# Altium project PCB__HMI3D_backup.PrjPCB
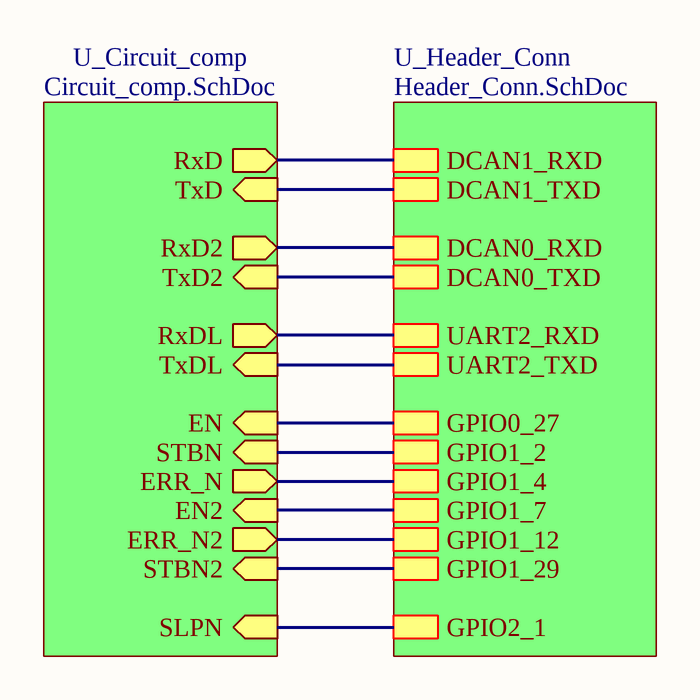
[diagram p0: Circuit.SchDoc]
9 sheets, 49 parts. Net scope: hierarchical (ports join the sheet entries above them; power ports are global).
Board file: Circuit.PcbDoc
Sheets:
  Circuit.SchDoc
  Power_Sources_2.SchDoc
    U_3 = 3.3V_REG_1mA.SchDoc
    U_5V_REG_EN = 5V_REG_EN.SchDoc
  3.3V_REG_1A.SchDoc
  3.3V_REG_EN.SchDoc
  Power_Sources.SchDoc
    U_EMI_Prot_1 = EMI_Prot.SchDoc
    U_EMI_Prot_2 = EMI_Prot.SchDoc
  EMI_Prot_Circ.SchDoc

## Sheet Circuit.SchDoc
size A4

### Sub-sheets
U_Circuit_comp = Circuit_comp.SchDoc (file not in this document): STBN2 (in), EN2 (in), TxD2 (in), ERR_N2 (out), RxD2 (out), RxDL (out), TxDL (in), SLPN (in), ERR_N (out), RxD (out), STBN (in), EN (in), TxD (in)
U_Header_Conn = Header_Conn.SchDoc (file not in this document): GPIO1_2, GPIO0_27, GPIO1_7, GPIO1_12, GPIO1_29, DCAN0_RXD, UART2_TXD, DCAN0_TXD, UART2_RXD, DCAN1_RXD, DCAN1_TXD, GPIO1_4, GPIO2_1

### Nets
(unnamed): sheet U_Circuit_comp/STBN2, sheet U_Header_Conn/GPIO1_29
(unnamed): sheet U_Circuit_comp/EN2, sheet U_Header_Conn/GPIO1_7
(unnamed): sheet U_Circuit_comp/TxD2, sheet U_Header_Conn/DCAN0_TXD
(unnamed): sheet U_Circuit_comp/ERR_N2, sheet U_Header_Conn/GPIO1_12
(unnamed): sheet U_Circuit_comp/RxD2, sheet U_Header_Conn/DCAN0_RXD
(unnamed): sheet U_Circuit_comp/RxDL, sheet U_Header_Conn/UART2_RXD
(unnamed): sheet U_Circuit_comp/TxDL, sheet U_Header_Conn/UART2_TXD
(unnamed): sheet U_Circuit_comp/SLPN, sheet U_Header_Conn/GPIO2_1
(unnamed): sheet U_Circuit_comp/ERR_N, sheet U_Header_Conn/GPIO1_4
(unnamed): sheet U_Circuit_comp/RxD, sheet U_Header_Conn/DCAN1_RXD
(unnamed): sheet U_Circuit_comp/STBN, sheet U_Header_Conn/GPIO1_2
(unnamed): sheet U_Circuit_comp/EN, sheet U_Header_Conn/GPIO0_27
(unnamed): sheet U_Circuit_comp/TxD, sheet U_Header_Conn/DCAN1_TXD

## Sheet Power_Sources_2.SchDoc
size A4
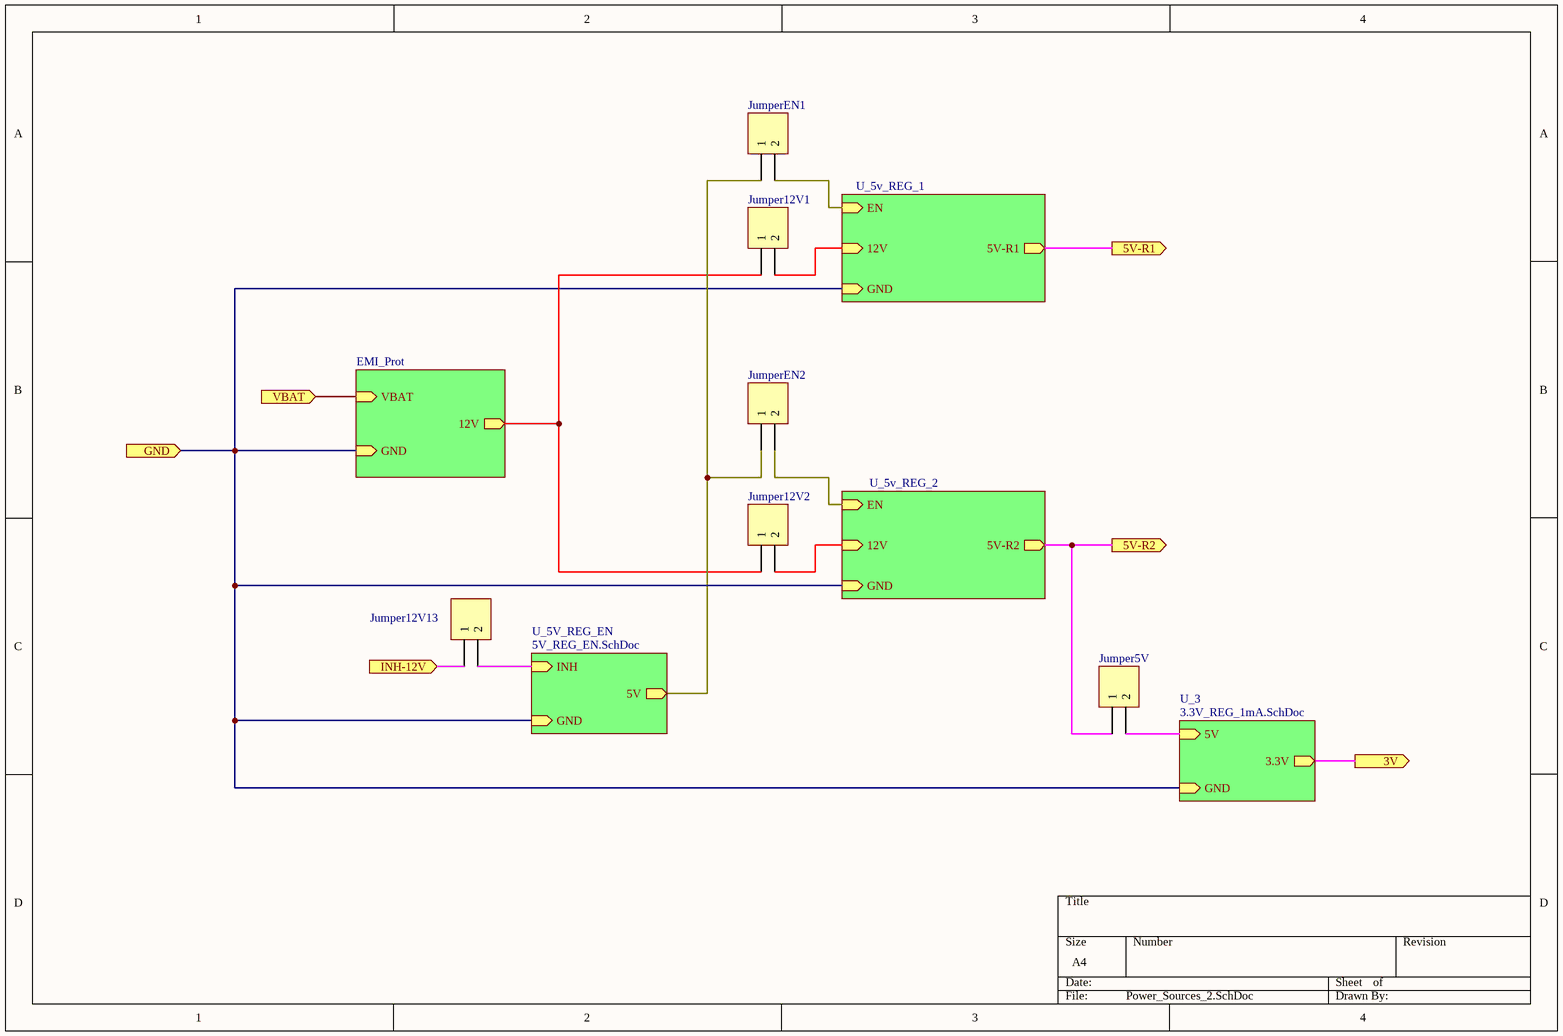
[diagram p1: Power_Sources_2.SchDoc]

### Parts
Jumper5V  Header 2H  [HDR1X2H]  (value not drawn)
Jumper12V1  Header 2H  [HDR1X2H]  (value not drawn)
Jumper12V2  Header 2H  [HDR1X2H]  (value not drawn)
Jumper12V13  Header 2H  [HDR1X2H]  (value not drawn)
JumperEN1  Header 2H  [HDR1X2H]  (value not drawn)
JumperEN2  Header 2H  [HDR1X2H]  (value not drawn)

### Sub-sheets
EMI_Prot = ?: VBAT (in), GND (in), 12V (out)
U_3 = 3.3V_REG_1mA.SchDoc: 5V (in), GND (in), 3.3V (out)
U_5v_REG_1 = ?: 12V (in), GND (in), EN (in), 5V-R1 (out)
U_5v_REG_2 = ?: 12V (in), GND (in), EN (in), 5V-R2 (out)
U_5V_REG_EN = 5V_REG_EN.SchDoc: INH (in), GND (in), 5V (out)

### Ports
3V (out), 5V-R1 (out), 5V-R2 (out), GND (in), INH-12V (in), VBAT (in)

### Nets
GND: port GND, sheet U_5v_REG_1/GND, sheet U_5v_REG_2/GND, sheet EMI_Prot/GND, sheet U_3/GND, sheet U_5V_REG_EN/GND
NetC?#1_1: port 3V, sheet U_3/3.3V
NetC?#2_2: Jumper5V.2 ; sheet U_3/5V
NetC?#4_1: JumperEN1.1 JumperEN2.1 ; sheet U_5V_REG_EN/5V
NetC?#5_2: Jumper12V13.2 ; sheet U_5V_REG_EN/INH
NetJumper5V_1: Jumper5V.1 ; port 5V-R2, sheet U_5v_REG_2/5V-R2
NetJumper12V1_1: Jumper12V1.1 Jumper12V2.1 ; sheet EMI_Prot/12V
NetJumper12V1_2: Jumper12V1.2 ; sheet U_5v_REG_1/12V
NetJumper12V2_2: Jumper12V2.2 ; sheet U_5v_REG_2/12V
NetJumper12V13_1: Jumper12V13.1 ; port INH-12V
NetJumperEN1_2: JumperEN1.2 ; sheet U_5v_REG_1/EN
NetJumperEN2_2: JumperEN2.2 ; sheet U_5v_REG_2/EN
(unnamed): port VBAT, sheet EMI_Prot/VBAT
(unnamed): port 5V-R1, sheet U_5v_REG_1/5V-R1

### Library data of the parts
Jumper5V Jumper12V1 Jumper12V2 Jumper12V13 JumperEN1 JumperEN2 = Header 2H: Header, 2-Pin, Right Angle; LatestRevisionDate: 17-Jul-2002; LatestRevisionNote: Re-released for DXP Platform.; Publisher: Altium Limited

## Sheet 3.3V_REG_1mA.SchDoc
size A4
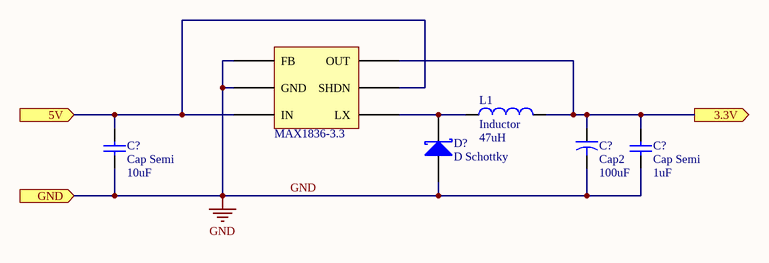
[diagram p2: 3.3V_REG_1mA.SchDoc]

### Parts
(Parts that share a designator on the sheet are numbered #1, #2 ... from top to bottom, then left to right.)
C?#1  Cap2  value 100uF  [CAPR5-4X5]
C?#2  Cap Semi  value 10uF  [C2512]
C?#3  Cap Semi  value 1uF  [C1206]
D?#1  D Schottky  [SMB]
L1#1  Inductor  value 47uH  [0402-A]
MAX1836-3.3#1  MAX1836-3.3V  [SOT23-MAX1836]  (value not drawn)

### Ports
3.3V (out), 5V (in), GND (in)

### Nets
GND: C?#1.2 C?#2.1 C?#3.1 D?#1.1(A) MAX1836-3.3#1.FB MAX1836-3.3#1.GND ; port GND
NetC?#1_1: C?#1.1 C?#3.2 L1#1.2 MAX1836-3.3#1.OUT ; port 3.3V
NetC?#2_2: C?#2.2 MAX1836-3.3#1.IN MAX1836-3.3#1.SHDN ; port 5V
NetD?#1_2: D?#1.2(K) L1#1.1 MAX1836-3.3#1.LX

### Library data of the parts
C?#1 = Cap2: Capacitor; Published: 23-Sep-2002; PackageReference: CAPR5-4X5; Publisher: Altium Limited; PackageDescription: Capacitor; 2 Leads
C?#2 C?#3 = Cap Semi: Capacitor (Semiconductor SIM Model); Published: 8-Jun-2000; LatestRevisionDate: 29-May-2009; LatestRevisionNote: IPC-7351 Footprint Added.; PackageReference: C1206; Publisher: Altium Limited; PackageDescription: Chip Capacitor
D?#1 = D Schottky: Schottky Diode; Published: 8-Jun-2000; LatestRevisionDate: 17-Jul-2002; LatestRevisionNote: Re-released for DXP Platform.; PackageReference: SMB; Publisher: Altium Limited; PackageDescription: DO-214-AA/SMB; 2 C-Bend Leads; Body 5.3 x 3.6 mm, inc. leads (LxW); Code_JEDEC: DO-214-AA
L1#1 = Inductor: Code_IEC: 1005; Published: 8-Jun-2000; LatestRevisionDate: 29-May-2009; LatestRevisionNote: IPC-7351 Footprint Added.; PackageReference: 0402-A; Publisher: Altium Limited; PackageDescription: Chip Inductor; Code_JEITA: 0402
MAX1836-3.3#1 = MAX1836-3.3V: 3.3V Fixed voltage regulator (125mA); HelpURL: http://www.mouser.com/ds/2/256/MAX1836-MAX1837-257737.pdf

## Sheet 5V_REG_EN.SchDoc
size A4
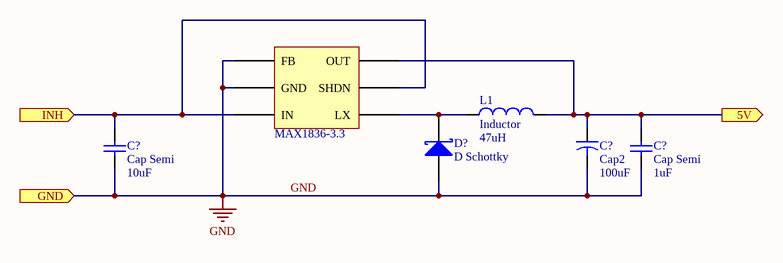
[diagram p3: 5V_REG_EN.SchDoc]

### Parts
(Parts that share a designator on the sheet are numbered #1, #2 ... from top to bottom, then left to right.)
C?#4  Cap2  value 100uF  [CAPR5-4X5]
C?#5  Cap Semi  value 10uF  [C2512]
C?#6  Cap Semi  value 1uF  [C1206]
D?#2  D Schottky  [SMB]
L1#2  Inductor  value 47uH  [0402-A]
MAX1836-3.3#2  MAX1836-3.3V  [SOT23-MAX1836]  (value not drawn)

### Ports
5V (out), GND (in), INH (in)

### Nets
GND: C?#4.2 C?#5.1 C?#6.1 D?#2.1(A) MAX1836-3.3#2.FB MAX1836-3.3#2.GND ; port GND
NetC?#4_1: C?#4.1 C?#6.2 L1#2.2 MAX1836-3.3#2.OUT ; port 5V
NetC?#5_2: C?#5.2 MAX1836-3.3#2.IN MAX1836-3.3#2.SHDN ; port INH
NetD?#2_2: D?#2.2(K) L1#2.1 MAX1836-3.3#2.LX

### Library data of the parts
C?#4 = Cap2: Capacitor; Published: 23-Sep-2002; PackageReference: CAPR5-4X5; Publisher: Altium Limited; PackageDescription: Capacitor; 2 Leads
C?#5 C?#6 = Cap Semi: Capacitor (Semiconductor SIM Model); Published: 8-Jun-2000; LatestRevisionDate: 29-May-2009; LatestRevisionNote: IPC-7351 Footprint Added.; PackageReference: C1206; Publisher: Altium Limited; PackageDescription: Chip Capacitor
D?#2 = D Schottky: Schottky Diode; Published: 8-Jun-2000; LatestRevisionDate: 17-Jul-2002; LatestRevisionNote: Re-released for DXP Platform.; PackageReference: SMB; Publisher: Altium Limited; PackageDescription: DO-214-AA/SMB; 2 C-Bend Leads; Body 5.3 x 3.6 mm, inc. leads (LxW); Code_JEDEC: DO-214-AA
L1#2 = Inductor: Code_IEC: 1005; Published: 8-Jun-2000; LatestRevisionDate: 29-May-2009; LatestRevisionNote: IPC-7351 Footprint Added.; PackageReference: 0402-A; Publisher: Altium Limited; PackageDescription: Chip Inductor; Code_JEITA: 0402
MAX1836-3.3#2 = MAX1836-3.3V: 3.3V Fixed voltage regulator (125mA); HelpURL: http://www.mouser.com/ds/2/256/MAX1836-MAX1837-257737.pdf

## Sheet 3.3V_REG_1A.SchDoc
size A4
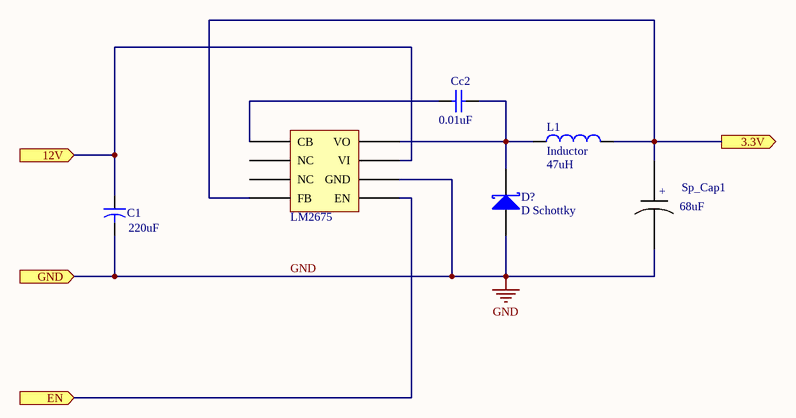
[diagram p4: 3.3V_REG_1A.SchDoc]

### Parts
(Parts that share a designator on the sheet are numbered #1, #2 ... from top to bottom, then left to right.)
C1#1  value 220uF  [CAPR5-4X5]  (hidden comment: Cap2)
Cc2  value 0.01uF  [C1206]  (hidden comment: Cap Semi)
D?#3  D Schottky  [SMB]
L1#3  Inductor  value 47uH  [0402-A]
LM2675  LM2675  [SOIC8-LM2675]  (value not drawn)
Sp_Cap1#1  value 68uF  (hidden comment: Sprague_capacitor)

### Ports
3.3V (out), 12V (in), EN (in), GND (in)

### Nets
GND: C1#1.2 D?#3.1(A) LM2675.GND Sp_Cap1#1.?2 ; port GND
NetC1#1_1: C1#1.1 LM2675.VI ; port 12V
NetCc2_1: Cc2.1 LM2675.CB
NetCc2_2: Cc2.2 D?#3.2(K) L1#3.1 LM2675.VO
NetL1#3_2: L1#3.2 LM2675.FB Sp_Cap1#1.?1 ; port 3.3V
NetLM2675_EN: LM2675.EN ; port EN

Not connected (* = marked no-connect by the designer): LM2675 NC

### Notes on the sheet
- (in symbol Sprague_capacitor) +

### Library data of the parts
C1#1 = Cap2: Capacitor; Published: 23-Sep-2002; PackageReference: CAPR5-4X5; Publisher: Altium Limited; PackageDescription: Capacitor; 2 Leads
Cc2 = Cap Semi: Capacitor (Semiconductor SIM Model); Published: 8-Jun-2000; LatestRevisionDate: 29-May-2009; LatestRevisionNote: IPC-7351 Footprint Added.; PackageReference: C1206; Publisher: Altium Limited; PackageDescription: Chip Capacitor
D?#3 = D Schottky: Schottky Diode; Published: 8-Jun-2000; LatestRevisionDate: 17-Jul-2002; LatestRevisionNote: Re-released for DXP Platform.; PackageReference: SMB; Publisher: Altium Limited; PackageDescription: DO-214-AA/SMB; 2 C-Bend Leads; Body 5.3 x 3.6 mm, inc. leads (LxW); Code_JEDEC: DO-214-AA
L1#3 = Inductor: Code_IEC: 1005; Published: 8-Jun-2000; LatestRevisionDate: 29-May-2009; LatestRevisionNote: IPC-7351 Footprint Added.; PackageReference: 0402-A; Publisher: Altium Limited; PackageDescription: Chip Inductor; Code_JEITA: 0402
LM2675 = LM2675: 3.3 Step-down (1A); HelpURL: http://www.ti.com/lit/ds/symlink/lm2675.pdf
Sp_Cap1#1 = Sprague_capacitor: Sprague Tantalum Capacitor; HelpURL: http://www.mouser.es/ProductDetail/Vishay-Sprague/594D686X0010C2T/?qs=sGAEpiMZZMuEN2agSAc2pn0KQ7q64aCR6Bnog1kvSjk%3d

## Sheet 3.3V_REG_EN.SchDoc
size A4
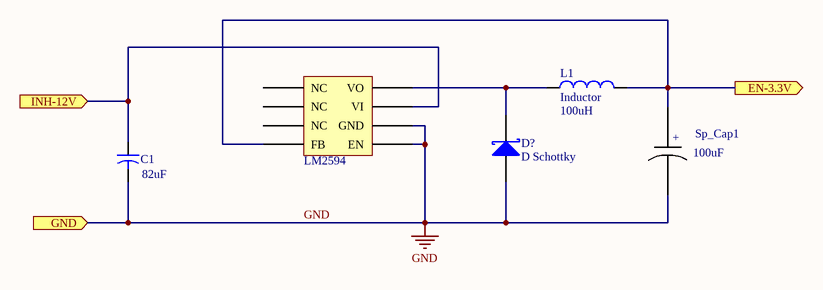
[diagram p5: 3.3V_REG_EN.SchDoc]

### Parts
(Parts that share a designator on the sheet are numbered #1, #2 ... from top to bottom, then left to right.)
C1#2  value 82uF  [CAPR5-4X5]  (hidden comment: Cap2)
D?#4  D Schottky  [SMB]
L1#4  Inductor  value 100uH  [0402-A]
LM2594  LM2594  [SOIC8-LM2594]  (value not drawn)
Sp_Cap1#2  value 100uF  (hidden comment: Sprague_capacitor)

### Ports
EN-3.3V (out), GND (in), INH-12V (in)

### Nets
GND: C1#2.2 D?#4.1(A) LM2594.EN LM2594.GND Sp_Cap1#2.?2 ; port GND
NetC1#2_1: C1#2.1 LM2594.VI ; port INH-12V
NetD?#4_2: D?#4.2(K) L1#4.1 LM2594.VO
NetL1#4_2: L1#4.2 LM2594.FB Sp_Cap1#2.?1 ; port EN-3.3V

Not connected (* = marked no-connect by the designer): LM2594 NC

### Notes on the sheet
- (in symbol Sprague_capacitor) +

### Library data of the parts
C1#2 = Cap2: Capacitor; Published: 23-Sep-2002; PackageReference: CAPR5-4X5; Publisher: Altium Limited; PackageDescription: Capacitor; 2 Leads
D?#4 = D Schottky: Schottky Diode; Published: 8-Jun-2000; LatestRevisionDate: 17-Jul-2002; LatestRevisionNote: Re-released for DXP Platform.; PackageReference: SMB; Publisher: Altium Limited; PackageDescription: DO-214-AA/SMB; 2 C-Bend Leads; Body 5.3 x 3.6 mm, inc. leads (LxW); Code_JEDEC: DO-214-AA
L1#4 = Inductor: Code_IEC: 1005; Published: 8-Jun-2000; LatestRevisionDate: 29-May-2009; LatestRevisionNote: IPC-7351 Footprint Added.; PackageReference: 0402-A; Publisher: Altium Limited; PackageDescription: Chip Inductor; Code_JEITA: 0402
LM2594 = LM2594: 3.3 Step-down (0.5A); HelpURL: http://www.ti.com/lit/ds/symlink/lm2594.pdf
Sp_Cap1#2 = Sprague_capacitor: Sprague Tantalum Capacitor; HelpURL: http://www.mouser.es/ProductDetail/Vishay-Sprague/594D686X0010C2T/?qs=sGAEpiMZZMuEN2agSAc2pn0KQ7q64aCR6Bnog1kvSjk%3d

## Sheet Power_Sources.SchDoc
size A4
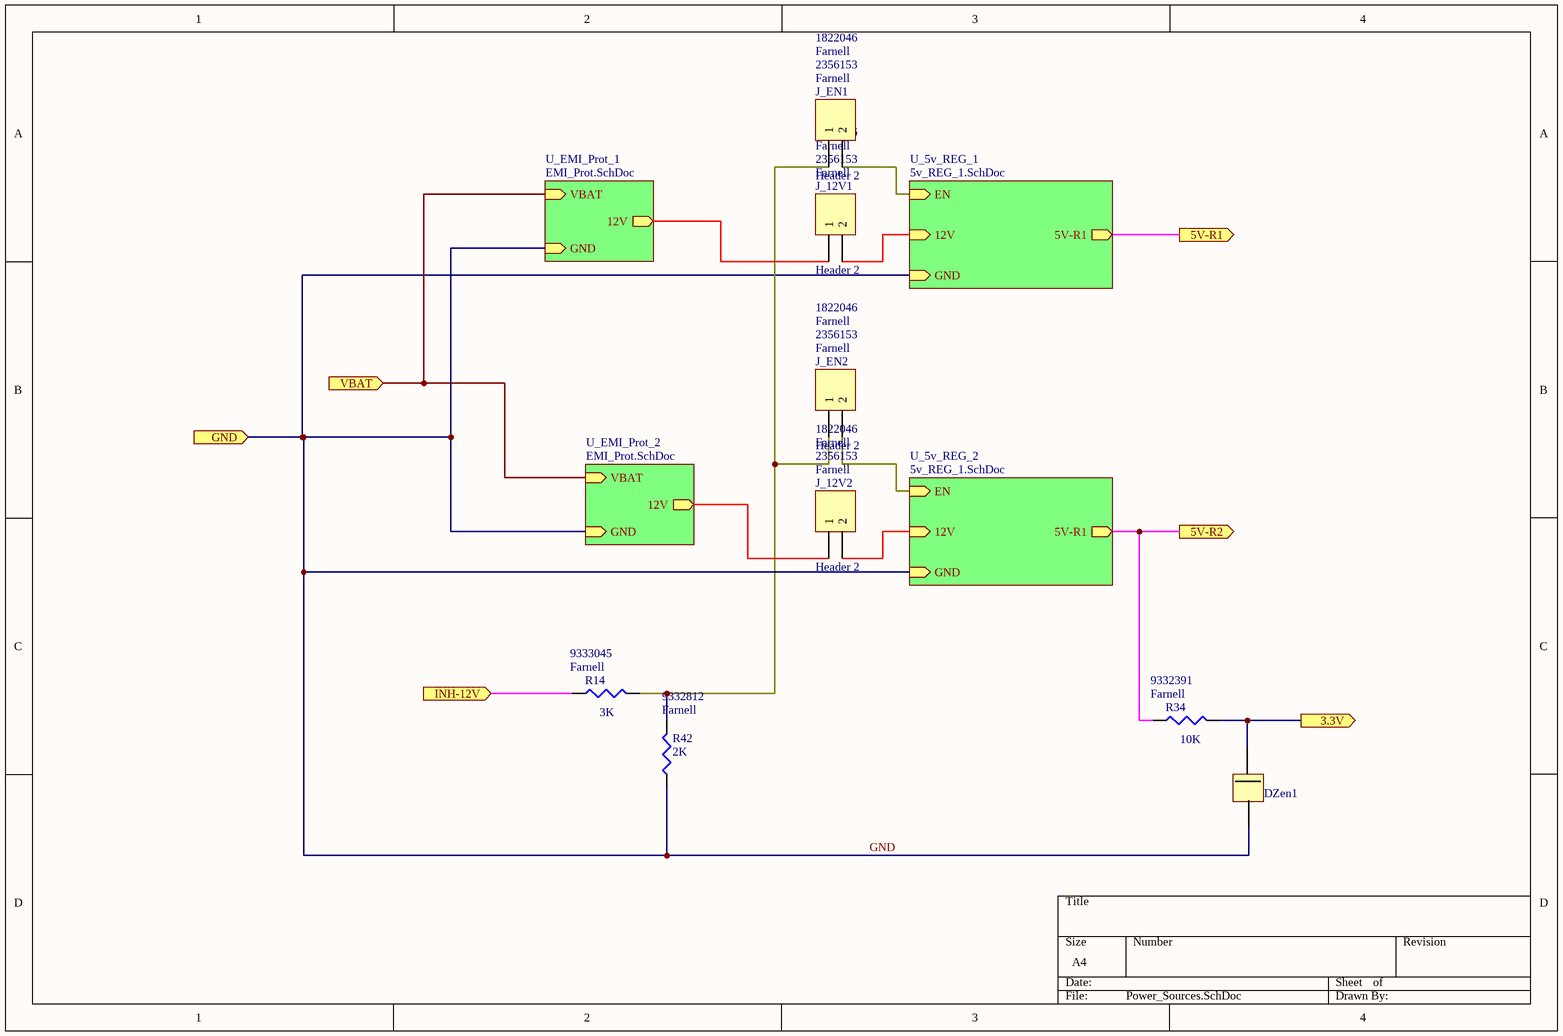
[diagram p6: Power_Sources.SchDoc]

### Parts
DZen1  3.3V  [Zener_Diode]  (value not drawn)
J_12V1  Header 2  Supplier 1: Farnell  Supplier Part Number 1: 2356153  Supplier Part Number 2: 1822046  [HDR1X2]
J_12V2  Header 2  Supplier 1: Farnell  Supplier Part Number 1: 2356153  Supplier Part Number 2: 1822046  [HDR1X2]
J_EN1  Header 2  Supplier 1: Farnell  Supplier Part Number 1: 2356153  Supplier Part Number 2: 1822046  [HDR1X2]
J_EN2  Header 2  Supplier 1: Farnell  Supplier Part Number 1: 2356153  Supplier Part Number 2: 1822046  [HDR1X2]
R14  Supplier 1: Farnell  Supplier Part Number 1: 9333045  [RES_0805]  (hidden comment: 3K)
R34  Supplier 1: Farnell  Supplier Part Number 1: 9332391  [RES_0805]  (hidden comment: 10K)
R42  Supplier 1: Farnell  Supplier Part Number 1: 9332812  [RES_0805]  (hidden comment: 2K)

### Sub-sheets
U_5v_REG_1 = 5v_REG_1.SchDoc (file not in this document): 12V (in), GND (in), EN (in), 5V-R1 (out)
U_5v_REG_2 = 5v_REG_1.SchDoc (file not in this document): 12V (in), GND (in), EN (in), 5V-R1 (out)
U_EMI_Prot_1 = EMI_Prot.SchDoc: VBAT (in), GND (in), 12V (out)
U_EMI_Prot_2 = EMI_Prot.SchDoc: VBAT (in), GND (in), 12V (out)

### Ports
3.3V (out), 5V-R1 (out), 5V-R2 (out), GND (in), INH-12V (in), VBAT (in)

### Nets
GND: DZen1.D2 R42.1 ; port GND, sheet U_5v_REG_1/GND, sheet U_5v_REG_2/GND, sheet U_EMI_Prot_1/GND, sheet U_EMI_Prot_2/GND
NetC1#3_1: port VBAT, sheet U_EMI_Prot_1/VBAT, sheet U_EMI_Prot_2/VBAT
NetDZen1_D1: DZen1.D1 R34.2 ; port 3.3V
NetJ_12V1_1: J_12V1.1 ; sheet U_EMI_Prot_1/12V
NetJ_12V1_2: J_12V1.2 ; sheet U_5v_REG_1/12V
NetJ_12V2_1: J_12V2.1 ; sheet U_EMI_Prot_2/12V
NetJ_12V2_2: J_12V2.2 ; sheet U_5v_REG_2/12V
NetJ_EN1_1: J_EN1.1 J_EN2.1 R14.2 R42.2
NetJ_EN1_2: J_EN1.2 ; sheet U_5v_REG_1/EN
NetJ_EN2_2: J_EN2.2 ; sheet U_5v_REG_2/EN
NetR14_1: R14.1 ; port INH-12V
NetR34_1: R34.1 ; port 5V-R2, sheet U_5v_REG_2/5V-R1
(unnamed): port 5V-R1, sheet U_5v_REG_1/5V-R1

### Library data of the parts
DZen1 = D_Zener: Zener Diode 3.3V; Supplier Part Number 1: 621-BZT52HC3V3WF-7; Supplier 1: Mouser; HelpURL: http://www.mouser.com/ds/2/115/BZT52HC2V4WF%20-%20BZT52HC47WF-948206.pdf
J_12V1 J_12V2 J_EN1 J_EN2 = Header 2: Header, 2-Pin; LatestRevisionDate: 17-Jul-2002; LatestRevisionNote: Re-released for DXP Platform.; Publisher: Altium Limited; Supplier 2: Farnell
R14 R34 R42 = Res3: Resistor; Published: 8-Jun-2000; LatestRevisionDate: 29-May-2009; LatestRevisionNote: IPC-7351 Footprint Added.; PackageReference: J1-0603; Publisher: Altium Limited; PackageDescription: Chip Resistor
  R14: Value: 3K
  R34: Value: 10K
  R42: Value: 2K

## Sheet EMI_Prot.SchDoc
size A4
Used 2 times, as channels U_EMI_Prot_1, U_EMI_Prot_2. Parts and nets are listed once, with the designators drawn on the sheet.
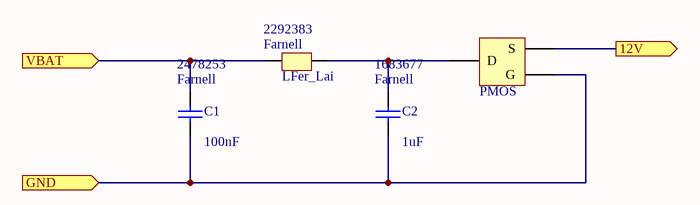
[diagram p7: EMI_Prot.SchDoc]

### Parts
C1  value 100nF  Supplier 1: Farnell  Supplier Part Number 1: 2478253  [CAP_0805]  (hidden comment: 100n)
C2  value 1uF  Supplier 1: Farnell  Supplier Part Number 1: 1683677  [CAP_0805]  (hidden comment: 1u)
LFer_Lai  Supplier 1: Farnell  Supplier Part Number 1: 2292383  [LFerrite_Laird]
PMOS  (no value)  [PMOS]

### Ports
12V (out), GND (in), VBAT (in)

### Nets
12V: PMOS.S ; port 12V
GND: C1.2 C2.2 PMOS.G ; port GND
VBAT: C1.1 LFer_Lai.1 ; port VBAT
NetC2_1: C2.1 LFer_Lai.2 PMOS.D

### Channels
U_EMI_Prot_1: designators C1=C1#3 C2=C2#1 LFer_Lai=LFer_L#1 PMOS=PMOS#1; ports 12V=NetJ_12V1_1 GND=GND VBAT=NetC1#3_1
U_EMI_Prot_2: designators C1=C1#4 C2=C2#2 LFer_Lai=LFer_L#2 PMOS=PMOS#2; ports 12V=NetJ_12V2_1 GND=GND VBAT=NetC1#3_1

### Library data of the parts
C1 C2 = Cap Semi: Capacitor; Published: 8-Jun-2000; LatestRevisionDate: 29-May-2009; LatestRevisionNote: IPC-7351 Footprint Added.; PackageReference: C1206; Publisher: Altium Limited; PackageDescription: Chip Capacitor
LFer_Lai = LFerrite_Laird: Laird ferrite chip bead; HelpURL: http://www.farnell.com/datasheets/1685731.pdf?_ga=1.185171822.65109063.1469090403
PMOS = PMOS: P channel Mosfet; HelpURL: http://www.mouser.com/ds/2/115/DMP6180SK3-247239.pdf

## Sheet EMI_Prot_Circ.SchDoc
size A4
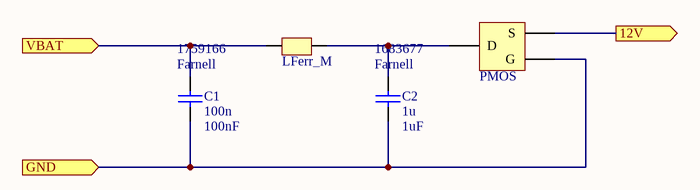
[diagram p8: EMI_Prot_Circ.SchDoc]

### Parts
(Parts that share a designator on the sheet are numbered #1, #2 ... from top to bottom, then left to right.)
C1#5  100n  value 100nF  Supplier 1: Farnell  Supplier Part Number 1: 1759166  [CAP_0805]
C2#3  1u  value 1uF  Supplier 1: Farnell  Supplier Part Number 1: 1683677  [CAP_0805]
LFerr_M  (no value)  [LFERRITE_MURATA_BLM21A]
PMOS#3  (no value)  [PMOS]

### Ports
12V (out), GND (in), VBAT (in)

### Nets
NetC1#5_1: C1#5.1 LFerr_M.1 ; port VBAT
NetC1#5_2: C1#5.2 C2#3.2 PMOS#3.G ; port GND
NetC2#3_1: C2#3.1 LFerr_M.2 PMOS#3.D
NetPMOS#3_S: PMOS#3.S ; port 12V

### Library data of the parts
C1#5 C2#3 = Cap Semi: Capacitor; Published: 8-Jun-2000; LatestRevisionDate: 29-May-2009; LatestRevisionNote: IPC-7351 Footprint Added.; PackageReference: C1206; Publisher: Altium Limited; PackageDescription: Chip Capacitor
LFerr_M = LFerrite_Murata: Murata ferrite chip bead - BLE32PN300SN1L; Impedance: 30ohm; MAX DC CUR: 10A; HelpURL: http://www.mouser.com/ds/2/281/c31e-522703.pdf; Supplier Part Number 1: 81-BLE32PN300SN1L; Supplier 1: Mouser
PMOS#3 = PMOS: P channel Mosfet; HelpURL: http://www.mouser.com/ds/2/115/DMP6180SK3-247239.pdf; Supplier 1: Mouser; Supplier Part Number 1: 621-DMP6180SK3-13

## Nets that join several sheets
GND: 3.3V_REG_1mA (6 pins), 5V_REG_EN (6 pins), 3.3V_REG_1A (C1#1.2 D?#3.1 LM2675.GND Sp_Cap1#1.?2), 3.3V_REG_EN (5 pins)
GND: Power_Sources (DZen1.D2 R42.1), U_EMI_Prot_1 (C1#3.2 C2#1.2 PMOS#1.G), U_EMI_Prot_2 (C1#4.2 C2#2.2 PMOS#2.G)
NetC1#3_1: U_EMI_Prot_1 (C1#3.1 LFer_L#1.1), U_EMI_Prot_2 (C1#4.1 LFer_L#2.1)
NetC?#2_2: Power_Sources_2 (Jumper5V.2), 3.3V_REG_1mA (C?#2.2 MAX1836-3.3#1.IN MAX1836-3.3#1.SHDN)
NetC?#4_1: Power_Sources_2 (JumperEN1.1 JumperEN2.1), 5V_REG_EN (C?#4.1 C?#6.2 L1#2.2 MAX1836-3.3#2.OUT)
NetC?#5_2: Power_Sources_2 (Jumper12V13.2), 5V_REG_EN (C?#5.2 MAX1836-3.3#2.IN MAX1836-3.3#2.SHDN)
NetJ_12V1_1: Power_Sources (J_12V1.1), U_EMI_Prot_1 (PMOS#1.S)
NetJ_12V2_1: Power_Sources (J_12V2.1), U_EMI_Prot_2 (PMOS#2.S)